# EAGLE design LED Matrix (EAGLE 6.1)
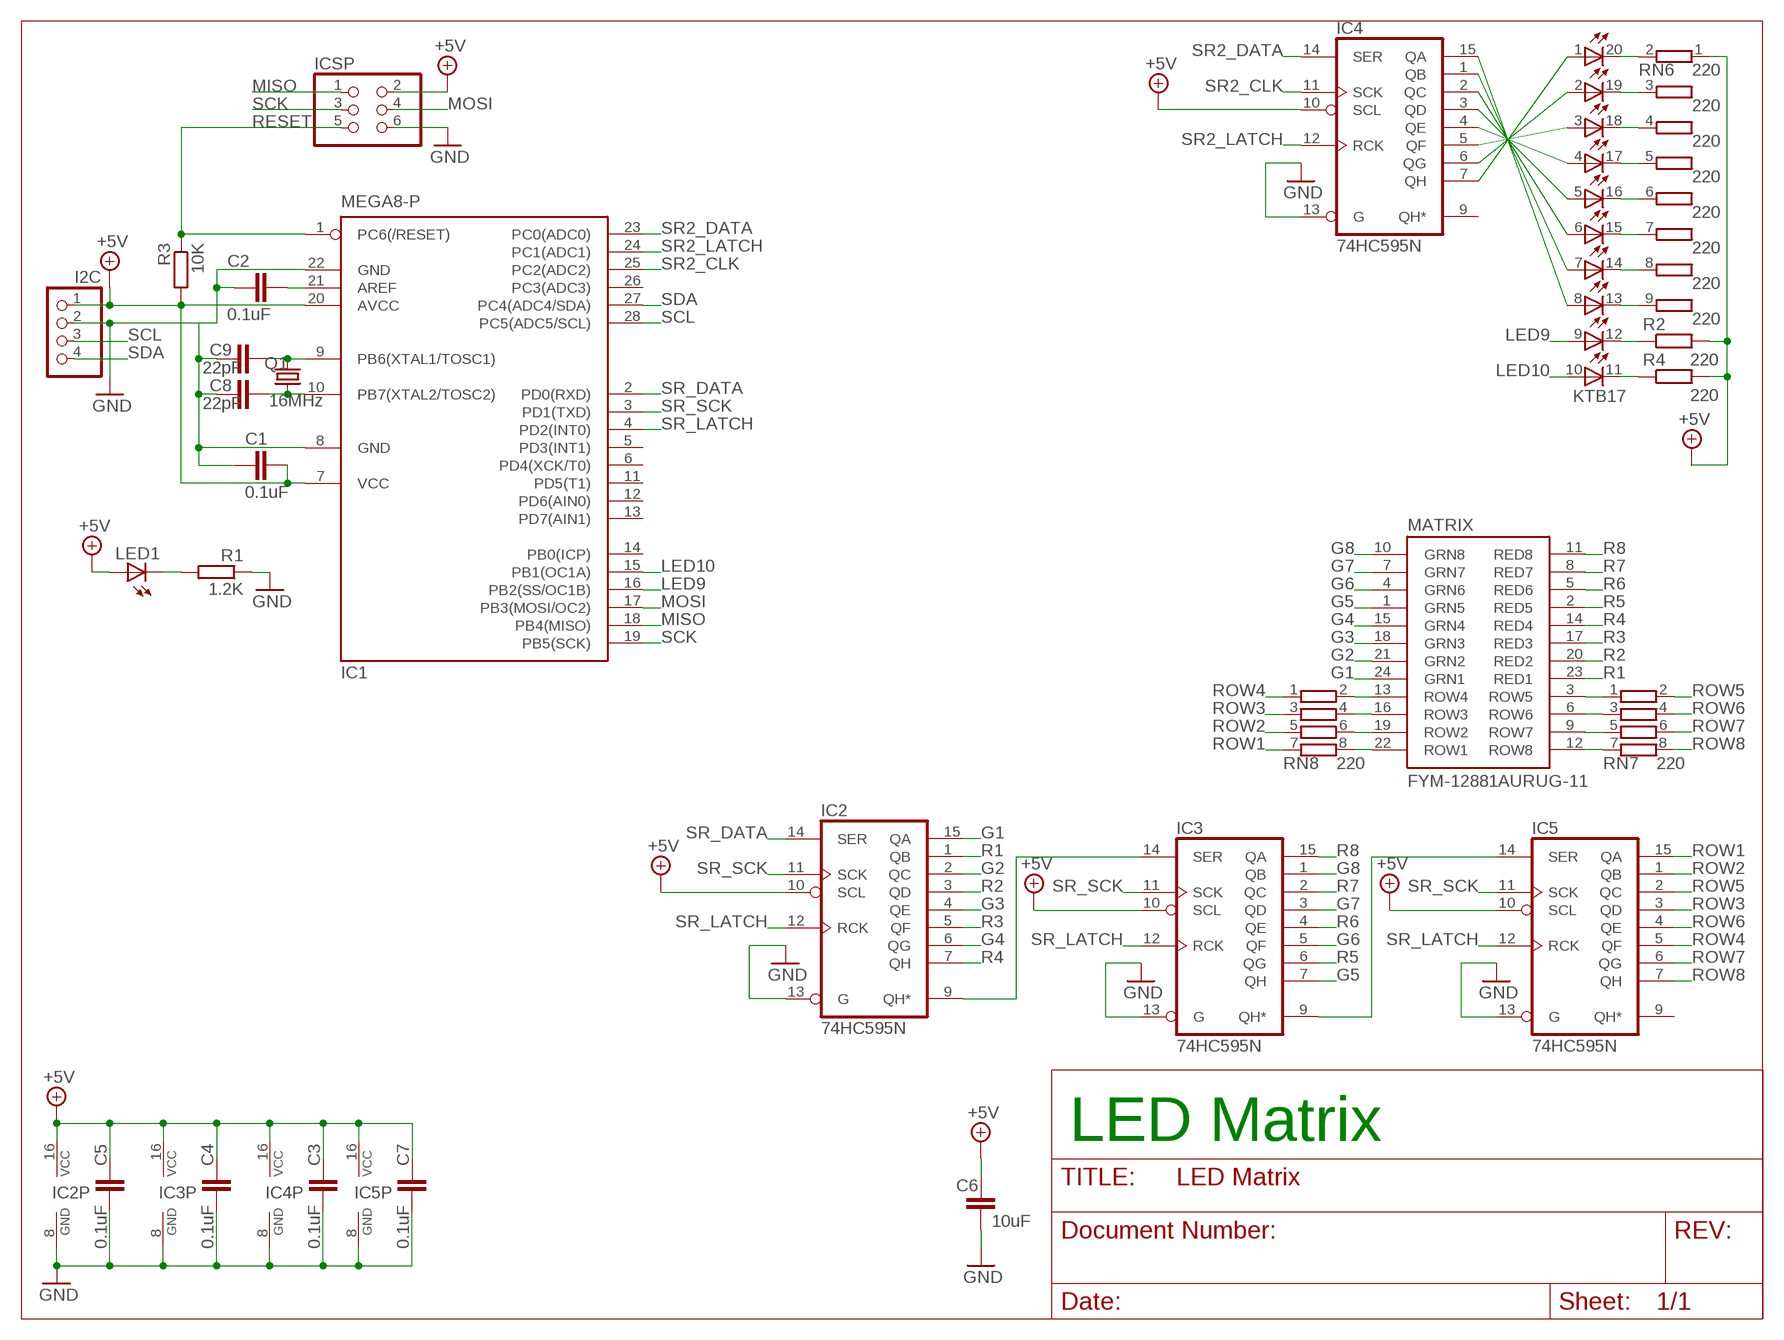
[diagram p0: schematic, sheet 1]

## Parts
-  KTB17  LB10  [LB10]
C1  0.1uF  C-EU025-024X044  [C025-024X044]
C2  0.1uF  C-EU025-024X044  [C025-024X044]
C3  0.1uF  C-EU025-024X044  [C025-024X044]
C4  0.1uF  C-EU025-024X044  [C025-024X044]
C5  0.1uF  C-EU025-024X044  [C025-024X044]
C6  10uF  C-EU025-024X044  [C025-024X044]
C7  0.1uF  C-EU025-024X044  [C025-024X044]
C8  22pF  C-EU025-024X044  [C025-024X044]
C9  22pF  C-EU025-024X044  [C025-024X044]
I2C  PINHD-1X4  [1X04]
IC1  MEGA8-P  [DIL28-3]
IC2  74HC595N  [DIL16]
IC3  74HC595N  [DIL16]
IC4  74HC595N  [DIL16]
IC5  74HC595N  [DIL16]
ICSP  PINHD-2X3  [2X03]
LED1  LED5MM  [LED5MM]
MATRIX  FYM-12881AURUG-11  YSM-1288CR3G2C  [YSM-1288CR3G2C]
Q1  16MHz  CRYSTALHC49S  [HC49/S]
R1  1.2K  R-EU_0207/2V  [0207/2V]
R2  220  R-EU_0207/2V  [0207/2V]
R3  10K  R-EU_0207/2V  [0207/2V]
R4  220  R-EU_0207/2V  [0207/2V]
RN6  220  GE08RP  [SIL9]
RN7  220  E4RP  [SIL8]
RN8  220  E4RP  [SIL8]

## Nets
+5V: C1.2 C3.1 C4.1 C5.1 C6.1 C7.1 I2C.1 IC1.7(VCC) IC1.20(AVCC) IC2.10(SCL) IC2.16(VCC) IC3.10(SCL) IC3.16(VCC) IC4.10(SCL) IC4.16(VCC) IC5.10(SCL) IC5.16(VCC) ICSP.2 LED1.A R2.2 R3.2 R4.2 RN6.1
G1: IC2.15(QA) MATRIX.24(GRN1)
G2: IC2.2(QC) MATRIX.21(GRN2)
G3: IC2.4(QE) MATRIX.18(GRN3)
G4: IC2.6(QG) MATRIX.15(GRN4)
G5: IC3.7(QH) MATRIX.1(GRN5)
G6: IC3.5(QF) MATRIX.4(GRN6)
G7: IC3.3(QD) MATRIX.7(GRN7)
G8: IC3.1(QB) MATRIX.10(GRN8)
GND: C1.1 C2.1 C3.2 C4.2 C5.2 C6.2 C7.2 C8.1 C9.1 I2C.2 IC1.8(GND) IC1.22(GND) IC2.8(GND) IC2.13(G) IC3.8(GND) IC3.13(G) IC4.8(GND) IC4.13(G) IC5.8(GND) IC5.13(G) ICSP.6 R1.1
LED9: -.9(-9:A) IC1.16(PB2(SS/OC1B))
LED10: -.10(-10:A) IC1.15(PB1(OC1A))
MISO: IC1.18(PB4(MISO)) ICSP.1
MOSI: IC1.17(PB3(MOSI/OC2)) ICSP.4
N$1: LED1.K(C) R1.2
N$2: -.1(-1:A) IC4.7(QH)
N$3: -.11(-10:C) R4.1
N$4: -.12(-9:C) R2.1
N$5: -.13(-8:C) RN6.9
N$6: -.14(-7:C) RN6.8
N$7: -.15(-6:C) RN6.7
N$8: -.16(-5:C) RN6.6
N$9: -.17(-4:C) RN6.5
N$10: -.18(-3:C) RN6.4
N$11: -.19(-2:C) RN6.3
N$12: -.20(-1:C) RN6.2
N$13: -.2(-2:A) IC4.6(QG)
N$14: -.3(-3:A) IC4.5(QF)
N$15: -.4(-4:A) IC4.4(QE)
N$16: -.5(-5:A) IC4.3(QD)
N$17: -.6(-6:A) IC4.2(QC)
N$18: -.7(-7:A) IC4.1(QB)
N$19: -.8(-8:A) IC4.15(QA)
N$21: C9.2 IC1.9(PB6(XTAL1/TOSC1)) Q1.2
N$22: C2.2 IC1.21(AREF)
N$23: IC3.9(QH*) IC5.14(SER)
N$24: C8.2 IC1.10(PB7(XTAL2/TOSC2)) Q1.1
N$28: IC2.9(QH*) IC3.14(SER)
N$33: MATRIX.13(ROW4) RN8.2
N$34: MATRIX.16(ROW3) RN8.4
N$35: MATRIX.19(ROW2) RN8.6
N$36: MATRIX.22(ROW1) RN8.8
N$37: MATRIX.3(ROW5) RN7.1
N$38: MATRIX.6(ROW6) RN7.3
N$39: MATRIX.9(ROW7) RN7.5
N$40: MATRIX.12(ROW8) RN7.7
R1: IC2.1(QB) MATRIX.23(RED1)
R2: IC2.3(QD) MATRIX.20(RED2)
R3: IC2.5(QF) MATRIX.17(RED3)
R4: IC2.7(QH) MATRIX.14(RED4)
R5: IC3.6(QG) MATRIX.2(RED5)
R6: IC3.4(QE) MATRIX.5(RED6)
R7: IC3.2(QC) MATRIX.8(RED7)
R8: IC3.15(QA) MATRIX.11(RED8)
RESET: IC1.1(PC6(/RESET)) ICSP.5 R3.1
ROW1: IC5.15(QA) RN8.7
ROW2: IC5.1(QB) RN8.5
ROW3: IC5.3(QD) RN8.3
ROW4: IC5.5(QF) RN8.1
ROW5: IC5.2(QC) RN7.2
ROW6: IC5.4(QE) RN7.4
ROW7: IC5.6(QG) RN7.6
ROW8: IC5.7(QH) RN7.8
SCK: IC1.19(PB5(SCK)) ICSP.3
SCL: I2C.3 IC1.28(PC5(ADC5/SCL))
SDA: I2C.4 IC1.27(PC4(ADC4/SDA))
SR2_CLK: IC1.25(PC2(ADC2)) IC4.11(SCK)
SR2_DATA: IC1.23(PC0(ADC0)) IC4.14(SER)
SR2_LATCH: IC1.24(PC1(ADC1)) IC4.12(RCK)
SR_DATA: IC1.2(PD0(RXD)) IC2.14(SER)
SR_LATCH: IC1.4(PD2(INT0)) IC2.12(RCK) IC3.12(RCK) IC5.12(RCK)
SR_SCK: IC1.3(PD1(TXD)) IC2.11(SCK) IC3.11(SCK) IC5.11(SCK)
Unconnected: IC1.5(PD3(INT1)) IC1.6(PD4(XCK/T0)) IC1.11(PD5(T1)) IC1.12(PD6(AIN0)) IC1.13(PD7(AIN1)) IC1.14(PB0(ICP)) IC1.26(PC3(ADC3)) IC4.9(QH*) IC5.9(QH*)

## Notes on the sheet
- LED Matrix

## Library data of the parts
- = led:LB10: LED BLOCK 10-LED bar graph, DIL, Siemens
C1-C9 = rcl:C-EU: CAPACITOR, European symbol
I2C = pinhead:PINHD-1X4: PIN HEADER
IC1 = atmel:MEGA8-P: MICROCONTROLLER 8 Kbytes FLASH, 1 kbytes SRAM, 512 bytes EEPROM, USART, 4-channel 10 bit ADC, 2-channel 8 bit ADC Pin compatible with Atmega48, ATMega88, ATMega168 Source: avr.lbr; OC_FARNELL: unknown; OC_NEWARK: unknown
IC2-IC5 = 74xx-eu:74*595: 8-bit SHIFT REGISTER, output latch
ICSP = pinhead:PINHD-2X3: PIN HEADER
LED1 = led:LED: LED OSRAM: - CHIPLED LG R971, LG N971, LY N971, LG Q971, LY Q971, LO R971, LY R971 LH N974, LH R974 LS Q976, LO Q976, LY Q976 LO Q996 - Hyper CHIPLED LW Q18S LB Q993, LB Q99A, LB R99A - SideLED LS A670, LO A670, LY A670, LG A670, LP A670 LB A673, LV A673, LT A673, LW A673 LH A674 LY A675 LS A676, LA A676, LO A676, LY A676, LW A676 LS A679, LY A679, LG A679 - Hyper Micro SIDELED® LS Y876, LA Y876, LO Y876, LY Y876 LT Y87S - SmartLED LW L88C, LW L88S LB L89C, LB L89S, LG L890 LS L89K, LO L89K, LY L89K LS L896, LA L896, LO L896, LY L896 - TOPLED LS T670, LO T670, LY T670, LG T670, LP T670 LSG T670, LSP T670, LSY T670, LOP T670, LYG T670 LG T671, LOG T671, LSG T671 LB T673, LV T673, LT T673, LW T673 LH T674 LS T676, LA T676, LO T676, LY T676, LB T676, LH T676, LSB T676, LW T676 LB T67C, LV T67C, LT T67C, LS T67K, LO T67K, LY T67K, LW E67C LS E67B, LA E67B, LO E67B, LY E67B, LB E67C, LV E67C, LT E67C LW T67C LS T679, LY T679, LG T679 LS T770, LO T770, LY T770, LG T770, LP T770 LB T773, LV T773, LT T773, LW T773 LH T774 LS E675, LA E675, LY E675, LS T675 LS T776, LA T776, LO T776, LY T776, LB T776 LHGB T686 LT T68C, LB T68C - Hyper Mini TOPLED® LB M676 - Mini TOPLED Santana® LG M470 LS M47K, LO M47K, LY M47K Source: http://www.osram.convergy.de LUXEON: - LUMILED® LXK2-PW12-R00, LXK2-PW12-S00, LXK2-PW14-U00, LXK2-PW14-V00 LXK2-PM12-R00, LXK2-PM12-S00, LXK2-PM14-U00 LXK2-PE12-Q00, LXK2-PE12-R00, LXK2-PE12-S00, LXK2-PE14-T00, LXK2-PE14-U00 LXK2-PB12-K00, LXK2-PB12-L00, LXK2-PB12-M00, LXK2-PB14-N00, LXK2-PB14-P00, LXK2-PB14-Q00 LXK2-PR12-L00, LXK2-PR12-M00, LXK2-PR14-Q00, LXK2-PR14-R00 LXK2-PD12-Q00, LXK2-PD12-R00, LXK2-PD12-S00 LXK2-PH12-R00, LXK2-PH12-S00 LXK2-PL12-P00, LXK2-PL12-Q00, LXK2-PL12-R00 Source: www.luxeon.com KINGBRIGHT: KA-3528ASYC Source: www.kingbright.com
MATRIX = led-matrix-v3:YSM-1288CR3G2C: LED Matrix - Dual Color (Red + Green) - Small sku: COM-00681 0.275 x 1.25 x 1.25"
Q1 = crystal:CRYSTAL: CRYSTAL; OC_FARNELL: 1667008; OC_NEWARK: unknown
R1-R4 = rcl:R-EU_: RESISTOR, European symbol
RN6 = resistor-sil:GE08RP: SIL RESISTOR; OC_FARNELL: unknown; OC_NEWARK: unknown
RN7 RN8 = resistor-sil:E4RP: SIL RESISTOR; OC_FARNELL: unknown; OC_NEWARK: unknown

## Board
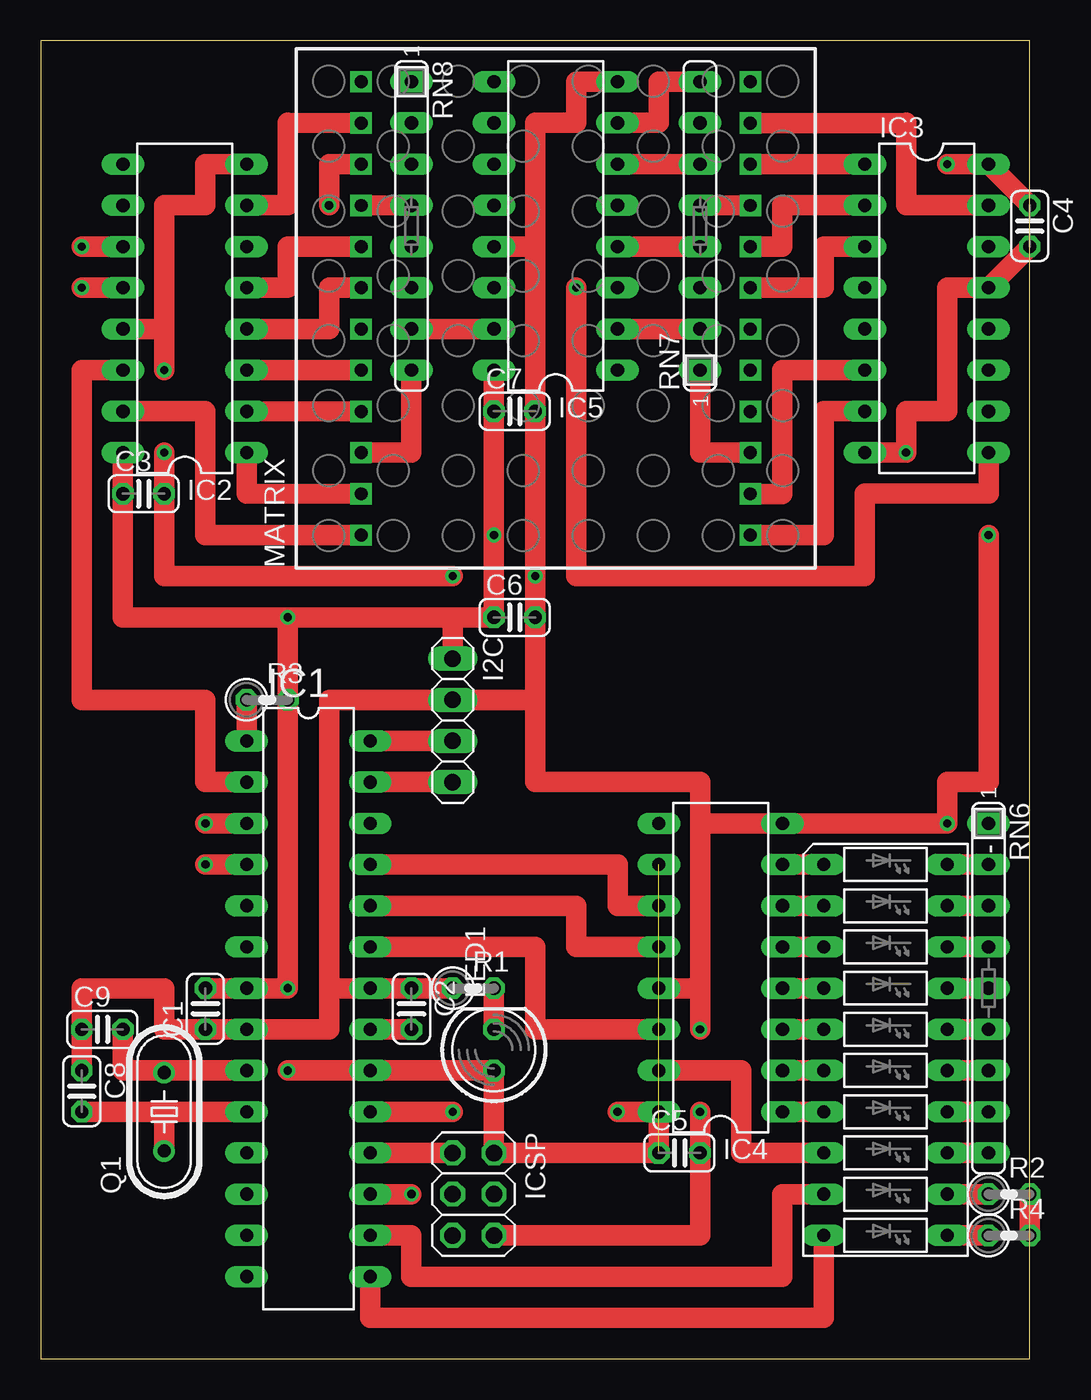
[diagram p1: board, top side]
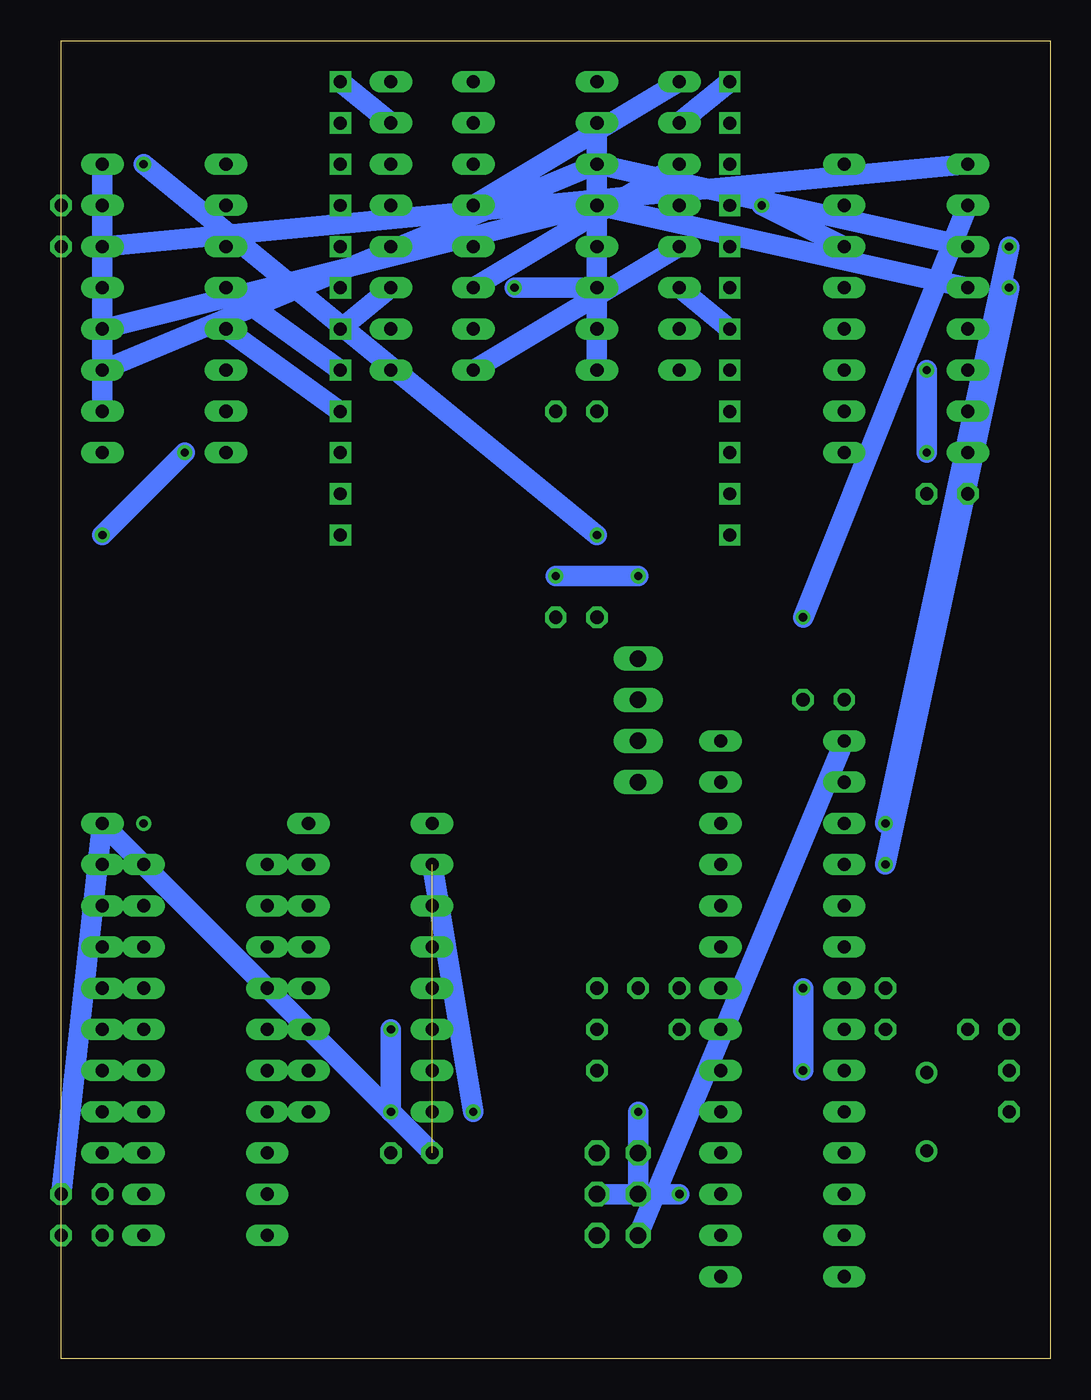
[diagram p2: board, bottom side, seen from below]

Size 60.96 x 81.28 mm. Coordinates in mm from the lower left corner, seen from the top.
Outline: 60.96,0 60.96,81.28 0,81.28 0,0 60.96,0
Copper layers (1*16): Top 0.035mm / dielectric 1.5mm / Bottom 0.035mm
Design rules: minimum track width 10mil, minimum drill 24mil, track to track 8mil, track to pad 8mil, pad to pad 8mil, via to via 8mil, smd to smd 8mil, copper to edge 40mil, drill to drill 8mil, minimum pad ring 10mil, minimum via ring 8mil, stop-mask expansion 4mil, vias tented up to drill 0mil, thermal gap 10mil

### Footprints (pad centres in the part's own frame; a part is rotated, then mirrored left to right if it is on the bottom)
LB10 = drill 0.813 long: 1 -11.43,-3.81; 2 -8.89,-3.81; 3 -6.35,-3.81; 4 -3.81,-3.81; 5 -1.27,-3.81; 6 1.27,-3.81; 7 3.81,-3.81; 8 6.35,-3.81; 9 8.89,-3.81; 10 11.43,-3.81; 11 11.43,3.81; 12 8.89,3.81; 13 6.35,3.81; 14 3.81,3.81; 15 1.27,3.81; 16 -1.27,3.81; 17 -3.81,3.81; 18 -6.35,3.81; 19 -8.89,3.81; 20 -11.43,3.81
C025-024X044 = drill 0.813 octagon: 1 -1.27,0; 2 1.27,0
1X04 = drill 1.016 long: 1 -3.81,0; 2 -1.27,0; 3 1.27,0; 4 3.81,0
DIL28-3 = drill 0.813 long: 1 -16.51,-3.81; 2 -13.97,-3.81; 3 -11.43,-3.81; 4 -8.89,-3.81; 5 -6.35,-3.81; 6 -3.81,-3.81; 7 -1.27,-3.81; 8 1.27,-3.81; 9 3.81,-3.81; 10 6.35,-3.81; 11 8.89,-3.81; 12 11.43,-3.81; 13 13.97,-3.81; 14 16.51,-3.81; 15 16.51,3.81; 16 13.97,3.81; 17 11.43,3.81; 18 8.89,3.81; 19 6.35,3.81; 20 3.81,3.81; 21 1.27,3.81; 22 -1.27,3.81; 23 -3.81,3.81; 24 -6.35,3.81; 25 -8.89,3.81; 26 -11.43,3.81; 27 -13.97,3.81; 28 -16.51,3.81
DIL16 = drill 0.813 long: 1 -8.89,-3.81; 2 -6.35,-3.81; 3 -3.81,-3.81; 4 -1.27,-3.81; 5 1.27,-3.81; 6 3.81,-3.81; 7 6.35,-3.81; 8 8.89,-3.81; 9 8.89,3.81; 10 6.35,3.81; 11 3.81,3.81; 12 1.27,3.81; 13 -1.27,3.81; 14 -3.81,3.81; 15 -6.35,3.81; 16 -8.89,3.81
2X03 = drill 1.016 octagon: 1 -2.54,-1.27; 2 -2.54,1.27; 3 0,-1.27; 4 0,1.27; 5 2.54,-1.27; 6 2.54,1.27
LED5MM = drill 0.813 octagon: A -1.27,0; K 1.27,0
YSM-1288CR3G2C = drill 0.8 square: 1 -13.975,-12; 2 -11.435,-12; 3 -8.895,-12; 4 -6.355,-12; 5 -3.815,-12; 6 -1.275,-12; 7 1.265,-12; 8 3.805,-12; 9 6.345,-12; 10 8.885,-12; 11 11.425,-12; 12 13.965,-12; 13 13.965,12; 14 11.425,12; 15 8.885,12; 16 6.345,12; 17 3.805,12; 18 1.265,12; 19 -1.275,12; 20 -3.815,12; 21 -6.355,12; 22 -8.895,12; 23 -11.435,12; 24 -13.975,12
HC49/S = drill 0.813: 1 -2.413,0; 2 2.413,0
0207/2V = drill 0.813 octagon: 1 -1.27,0; 2 1.27,0
SIL9 = drill 0.813 long: 1 -10.16,0; 2 -7.62,0; 3 -5.08,0; 4 -2.54,0; 5 0,0; 6 2.54,0; 7 5.08,0; 8 7.62,0; 9 10.16,0
SIL8 = drill 0.813 long: 1 -8.89,0; 2 -6.35,0; 3 -3.81,0; 4 -1.27,0; 5 1.27,0; 6 3.81,0; 7 6.35,0; 8 8.89,0

### Placement (x,y rotation side)
-  52.07,19.05 270 top
C1  10.16,21.59 90 top
C2  22.86,21.59 270 top
C3  6.35,53.34 0 top
C4  60.96,69.85 270 top
C5  39.37,12.7 0 top
C6  29.21,45.72 0 top
C7  29.21,58.42 0 top
C8  2.54,16.51 270 top
C9  3.81,20.32 0 top
I2C  25.4,39.37 270 top
IC1  16.51,21.59 270 top
IC2  8.89,64.77 90 top
IC3  54.61,64.77 270 top
IC4  41.91,24.13 90 top
IC5  31.75,69.85 90 top
ICSP  26.67,10.16 270 top
LED1  27.94,19.05 90 top
MATRIX  31.75,64.77 90 top
Q1  7.62,15.24 90 top
R1  26.67,22.86 0 top
R2  59.69,10.16 0 top
R3  13.97,40.64 0 top
R4  59.69,7.62 0 top
RN6  58.42,22.86 270 top
RN7  40.64,69.85 90 top
RN8  22.86,69.85 270 top

### Tracks (layer width: path | path; a pad name or v marks a point on that pad's centre or on a via)
+5V  (via drill 0.51)  (1 unrouted)
  Top 1.27: IC5.16 C7.1 v27.94,50.8 C6.1 25.4,45.72 | IC2.16 C3.1 5.08,45.72 12.7,45.72 v15.24,45.72 | v15.24,17.78 IC1.20 LED1.A ICSP.2 C5.1 IC4.16 v35.56,15.24 | v55.88,73.66 IC3.16 C4.1 | 25.4,45.72 v15.24,45.72 | I2C.1 25.4,45.72 | v15.24,45.72 R3.2 v15.24,22.86 IC1.7 C1.2 | R4.2 R2.2
  Bottom 1.27: v15.24,17.78 v15.24,22.86 | v55.88,73.66 v27.94,50.8 | v35.56,15.24 IC4.10 | IC3.10 IC3.16 | IC5.10 IC5.16 | IC2.10 v15.24,45.72 | R2.2 RN6.1 C5.1
G1
  Top 1.27: MATRIX.24 10.16,50.8 10.16,58.42 IC2.15
G2
  Top 1.27: MATRIX.21 IC2.2
G3
  Top 1.27: IC2.4 17.78,63.5 17.78,66.04 MATRIX.18
G4  (via drill 0.51)
  Top 1.27: v17.78,71.12 17.78,73.66 MATRIX.15
  Bottom 1.27: IC2.6 v17.78,71.12
G5
  Top 1.27: IC3.7 48.26,58.42 48.26,50.8 45.72,50.8 MATRIX.1
G6
  Bottom 1.27: MATRIX.4 IC3.5
G7
  Top 1.27: IC3.3 48.26,68.58 48.26,66.04 45.72,66.04 45.72,66.03 MATRIX.7
G8
  Top 1.27: IC3.1 45.72,73.66 MATRIX.10
GND  (via drill 0.51)
  Top 1.27: IC5.8 33.02,78.74 33.02,76.2 30.48,76.2 30.48,68.58 | IC5.13 30.48,68.58 | 30.48,68.58 C7.2 v30.48,48.26 C6.2 30.48,40.64 | 17.78,22.86 17.78,20.32 IC1.8 C1.1 7.62,20.32 7.62,22.86 2.54,22.86 C9.1 C8.1 | 17.78,22.86 IC1.22 C2.1 R1.1 | 17.78,22.86 17.78,40.64 I2C.2 30.48,40.64 | v40.64,20.32 40.64,22.86 | 40.64,22.86 40.64,33.02 | IC2.8 10.16,73.66 10.16,71.12 7.62,71.12 7.62,63.5 | v7.62,60.96 7.62,63.5 | IC2.13 7.62,63.5 | v25.4,48.26 7.62,48.26 C3.2 v7.62,55.88 | IC3.8 v53.34,55.88 53.34,58.42 55.88,58.42 55.88,66.04 IC3.13 C4.2 | IC4.13 40.64,22.86 | 40.64,33.02 IC4.8 v55.88,33.02 55.88,35.56 58.42,35.56 v58.42,50.8 | 40.64,33.02 40.64,35.56 30.48,35.56 30.48,40.64 | v40.64,15.24 C5.2 40.64,7.62 ICSP.6
  Bottom 1.27: v40.64,15.24 v40.64,20.32 | v7.62,60.96 v7.62,55.88 | v25.4,48.26 v30.48,48.26 | v58.42,50.8 v53.34,55.88
LED9
  Top 1.27: IC1.16 22.86,7.62 22.86,5.08 45.72,5.08 45.72,10.16 -.9
LED10
  Top 1.27: IC1.15 20.32,2.54 48.26,2.54 -.10
MISO
  Top 1.27: ICSP.1 IC1.18
MOSI  (via drill 0.51)
  Top 1.27: v22.86,10.16 IC1.17
  Bottom 1.27: ICSP.4 v22.86,10.16
N$1
  Top 1.27: R1.2 LED1.K
N$2
  Top 1.27: IC4.7 -.1
N$3
  Top 1.27: R4.1 -.11
N$4
  Top 1.27: -.12 R2.1
N$5
  Top 1.27: RN6.9 -.13
N$6
  Top 1.27: -.14 RN6.8
N$7
  Top 1.27: RN6.7 -.15
N$8
  Top 1.27: -.16 RN6.6
N$9
  Top 1.27: RN6.5 -.17
N$10
  Top 1.27: -.18 RN6.4
N$11
  Top 1.27: RN6.3 -.19
N$12
  Top 1.27: -.20 RN6.2
N$13
  Top 1.27: -.2 IC4.6
N$14
  Top 1.27: IC4.5 -.3
N$15
  Top 1.27: -.4 IC4.4
N$16
  Top 1.27: IC4.3 -.5
N$17
  Top 1.27: -.6 IC4.2
N$18
  Top 1.27: -.7 IC4.1
N$19
  Top 1.27: -.8 43.18,12.7 43.18,17.78 IC4.15
N$21
  Top 1.27: 7.62,17.78 IC1.9 | C9.2 5.08,17.78 7.62,17.78 | 7.62,17.78 Q1.2
N$22
  Top 1.27: C2.2 IC1.21
N$23  (via drill 0.51)
  Top 1.27: v33.02,66.04 33.02,48.26 50.8,48.26 50.8,53.34 58.42,53.34 IC3.9
  Bottom 1.27: v33.02,66.04 IC5.14
N$24
  Top 1.27: IC1.10 7.62,15.24 | 7.62,15.24 C8.2 | Q1.1 7.62,15.24
N$28
  Bottom 1.27: IC3.14 IC2.9
N$33
  Bottom 1.27: RN8.2 MATRIX.13
N$34
  Top 1.27: RN8.4 MATRIX.16
N$35
  Bottom 1.27: MATRIX.19 RN8.6
N$36
  Top 1.27: RN8.8 22.86,55.88 MATRIX.22
N$37
  Top 1.27: RN7.1 40.64,55.88 40.65,55.88 MATRIX.3
N$38
  Bottom 1.27: RN7.3 MATRIX.6
N$39
  Top 1.27: RN7.5 MATRIX.9
N$40
  Bottom 1.27: RN7.7 MATRIX.12
R1
  Top 1.27: MATRIX.23 12.7,53.34 IC2.1
R2
  Top 1.27: MATRIX.20 IC2.3
R3
  Top 1.27: MATRIX.17 15.24,68.58 15.24,66.04 IC2.5
R4
  Top 1.27: IC2.7 15.24,71.12 15.24,76.2 MATRIX.14
R5
  Top 1.27: IC3.6 45.72,60.96 45.72,53.34 MATRIX.2
R6
  Bottom 1.27: MATRIX.5 IC3.4
R7
  Top 1.27: IC3.2 45.72,71.12 45.72,68.58 MATRIX.8
R8
  Top 1.27: MATRIX.11 53.34,76.19 | 53.34,76.19 53.34,76.2 | 53.34,76.19 53.34,71.12 IC3.15
RESET
  Top 1.27: R3.1 IC1.1
  Bottom 1.27: ICSP.5 IC1.1
ROW1
  Top 1.27: IC5.15 RN8.7
ROW2
  Bottom 1.27: IC5.1 RN8.5
ROW3
  Bottom 1.27: IC5.3 RN8.3
ROW4
  Bottom 1.27: IC5.5 RN8.1
ROW5
  Top 1.27: IC5.2 RN7.2
ROW6
  Top 1.27: IC5.4 RN7.4
ROW7
  Top 1.27: RN7.6 IC5.6
ROW8
  Top 1.27: IC5.7 38.1,76.2 38.1,78.74 RN7.8
SCK  (via drill 0.51)
  Top 1.27: v25.4,15.24 IC1.19
  Bottom 1.27: ICSP.3 v25.4,15.24
SCL
  Top 1.27: I2C.3 IC1.28
SDA
  Top 1.27: IC1.27 I2C.4
SR2_CLK
  Top 1.27: IC1.25 35.56,30.48 35.56,27.94 IC4.11
SR2_DATA
  Top 1.27: IC1.23 30.48,25.4 30.48,20.32 IC4.14
SR2_LATCH
  Top 1.27: IC1.24 33.02,27.94 33.02,25.4 IC4.12
SR_DATA
  Top 1.27: IC2.14 2.54,60.96 2.54,40.64 10.16,40.64 10.16,35.56 IC1.2
SR_LATCH  (via drill 0.51)
  Top 1.27: IC2.12 v2.54,66.04 | v10.16,30.48 IC1.4
  Bottom 1.27: IC3.12 IC5.12 IC2.12 | v2.54,66.04 v10.16,30.48
SR_SCK  (via drill 0.51)
  Top 1.27: IC1.3 v10.16,33.02 | v2.54,68.58 IC2.11
  Bottom 1.27: IC3.11 IC5.11 IC2.11 | v10.16,33.02 v2.54,68.58